# Altium schematic sheet OutputJack.SchDoc
size A4; CompanyName: Technische Hochschule Nürnberg Georg Simon Ohm; Address1: Fürther Straße 250; Address2: 90429 Nürnberg; Address3: GERMANY; SheetNumber: 11; SheetTotal: 21; CompanyName2: Institut ELSYS
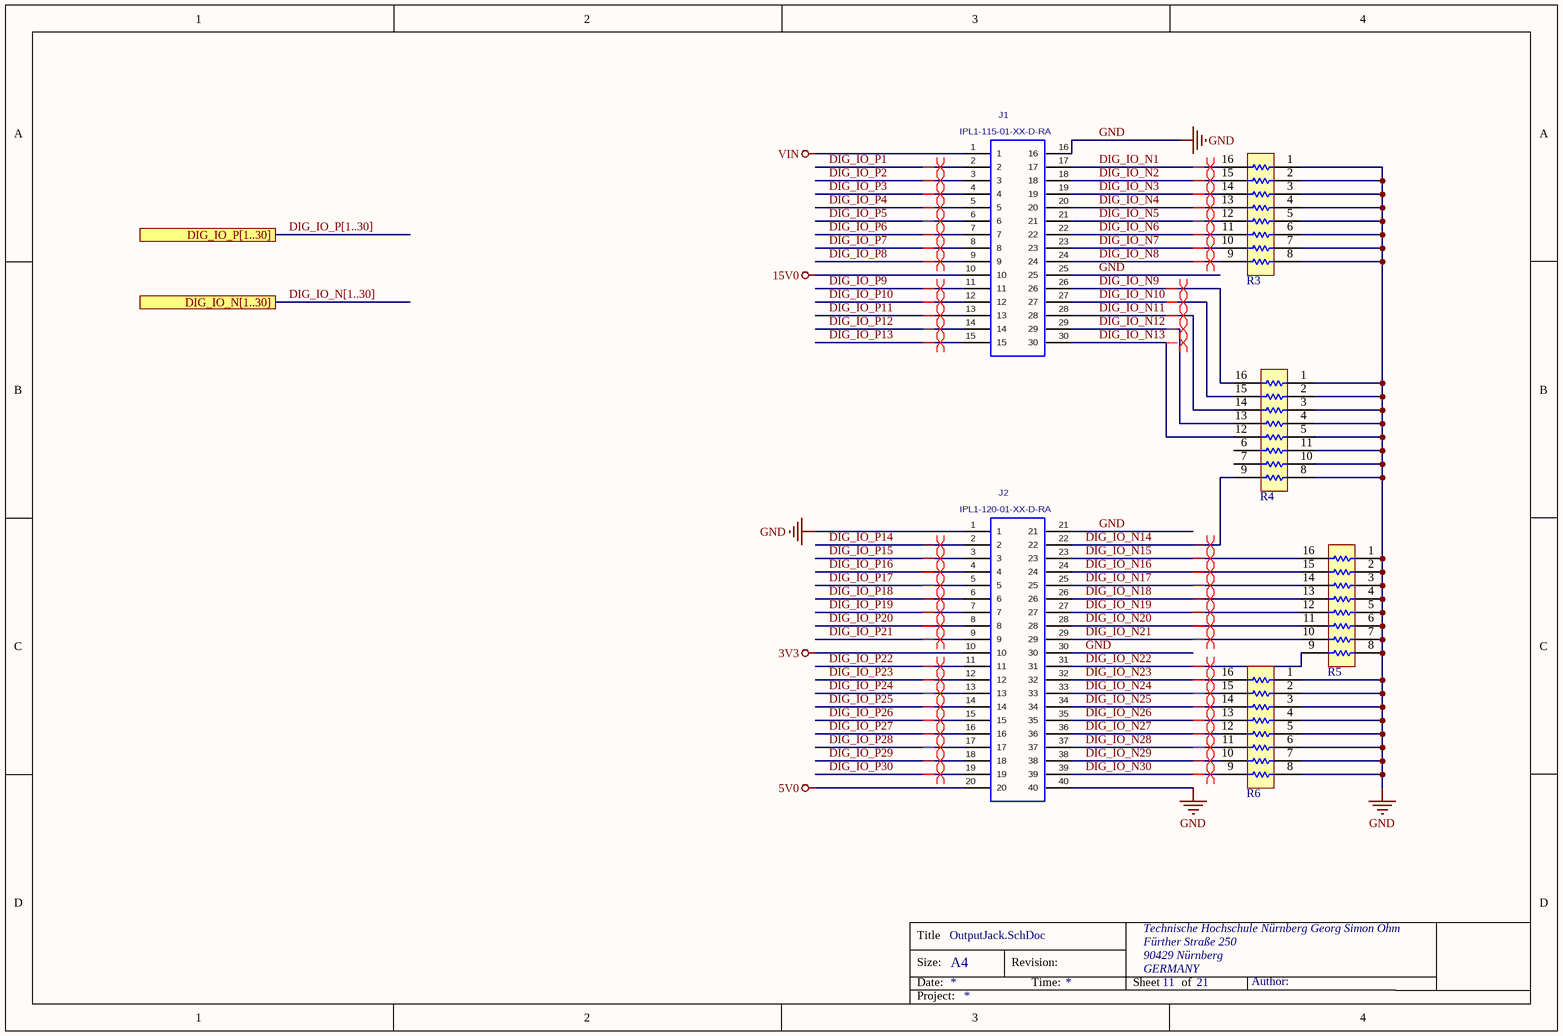
[diagram p0: OutputJack.SchDoc]

## Parts
J1  IPL1-115-01-XX-D-RA  [IPL1-115-01-XX-D-RA]
J2  IPL1-120-01-XX-D-RA  [IPL1-120-01-XX-D-RA]
R3  0.063W  [RESCAXE-50P380X160X45-16N]  (value not drawn)
R4  0.063W  [RESCAXE-50P380X160X45-16N]  (value not drawn)
R5  0.063W  [RESCAXE-50P380X160X45-16N]  (value not drawn)
R6  0.063W  [RESCAXE-50P380X160X45-16N]  (value not drawn)

## Ports
DIG_IO_N[1..30] (harness DIG_O_15V), DIG_IO_P[1..30] (harness DIG_O_15V)

## Nets
3V3: J2.10
5V0: J2.20
15V0: J1.10
GND: J1.16 J1.25 J2.1 J2.21 J2.30 J2.40 R3.1 R3.2 R3.3 R3.4 R3.5 R3.6 R3.7 R3.8 R4.1 R4.2 R4.3 R4.4 R4.5 R4.8 R4.10 R4.11 R5.1 R5.2 R5.3 R5.4 R5.5 R5.6 R5.7 R5.8 R6.1 R6.2 R6.3 R6.4 R6.5 R6.6 R6.7 R6.8
VIN: J1.1
DIG_IO_N1: J1.17 R3.16
DIG_IO_N2: J1.18 R3.15
DIG_IO_N3: J1.19 R3.14
DIG_IO_N4: J1.20 R3.13
DIG_IO_N5: J1.21 R3.12
DIG_IO_N6: J1.22 R3.11
DIG_IO_N7: J1.23 R3.10
DIG_IO_N8: J1.24 R3.9
DIG_IO_N9: J1.26 R4.16
DIG_IO_N10: J1.27 R4.15
DIG_IO_N11: J1.28 R4.14
DIG_IO_N12: J1.29 R4.13
DIG_IO_N13: J1.30 R4.12
DIG_IO_N14: J2.22 R4.9
DIG_IO_N15: J2.23 R5.16
DIG_IO_N16: J2.24 R5.15
DIG_IO_N17: J2.25 R5.14
DIG_IO_N18: J2.26 R5.13
DIG_IO_N19: J2.27 R5.12
DIG_IO_N20: J2.28 R5.11
DIG_IO_N21: J2.29 R5.10
DIG_IO_N22: J2.31 R5.9
DIG_IO_N23: J2.32 R6.16
DIG_IO_N24: J2.33 R6.15
DIG_IO_N25: J2.34 R6.14
DIG_IO_N26: J2.35 R6.13
DIG_IO_N27: J2.36 R6.12
DIG_IO_N28: J2.37 R6.11
DIG_IO_N29: J2.38 R6.10
DIG_IO_N30: J2.39 R6.9
DIG_IO_P1: J1.2
DIG_IO_P2: J1.3
DIG_IO_P3: J1.4
DIG_IO_P4: J1.5
DIG_IO_P5: J1.6
DIG_IO_P6: J1.7
DIG_IO_P7: J1.8
DIG_IO_P8: J1.9
DIG_IO_P9: J1.11
DIG_IO_P10: J1.12
DIG_IO_P11: J1.13
DIG_IO_P12: J1.14
DIG_IO_P13: J1.15
DIG_IO_P14: J2.2
DIG_IO_P15: J2.3
DIG_IO_P16: J2.4
DIG_IO_P17: J2.5
DIG_IO_P18: J2.6
DIG_IO_P19: J2.7
DIG_IO_P20: J2.8
DIG_IO_P21: J2.9
DIG_IO_P22: J2.11
DIG_IO_P23: J2.12
DIG_IO_P24: J2.13
DIG_IO_P25: J2.14
DIG_IO_P26: J2.15
DIG_IO_P27: J2.16
DIG_IO_P28: J2.17
DIG_IO_P29: J2.18
DIG_IO_P30: J2.19

Not connected (* = marked no-connect by the designer): R4 6 7

## Buses and harness runs
bus DIG_IO_N[1..30]
bus DIG_IO_P[1..30]

## Layout directives
differential pair: DIG_IO_N1, DIG_IO_N2, DIG_IO_N3, DIG_IO_N4, DIG_IO_N5, DIG_IO_N6, DIG_IO_N7, DIG_IO_N8, DIG_IO_N9, DIG_IO_N10, DIG_IO_N11, DIG_IO_N12, DIG_IO_N13, DIG_IO_N14, DIG_IO_N15, DIG_IO_N16, DIG_IO_N17, DIG_IO_N18, DIG_IO_N19, DIG_IO_N20, DIG_IO_N21, DIG_IO_N22, DIG_IO_N23, DIG_IO_N24, DIG_IO_N25, DIG_IO_N26, DIG_IO_N27, DIG_IO_N28, DIG_IO_N29, DIG_IO_N30, DIG_IO_P1, DIG_IO_P2, DIG_IO_P3, DIG_IO_P4, DIG_IO_P5, DIG_IO_P6, DIG_IO_P7, DIG_IO_P8, DIG_IO_P9, DIG_IO_P10, DIG_IO_P11, DIG_IO_P12, DIG_IO_P13, DIG_IO_P14, DIG_IO_P15, DIG_IO_P16, DIG_IO_P17, DIG_IO_P18, DIG_IO_P19, DIG_IO_P20, DIG_IO_P21, DIG_IO_P22, DIG_IO_P23, DIG_IO_P24, DIG_IO_P25, DIG_IO_P26, DIG_IO_P27, DIG_IO_P28, DIG_IO_P29, DIG_IO_P30

## Notes on the sheet
- Title
- Size:
- Date:
- A4
- Revision:
- Time:
- Sheet
- of
- Author:
- Project:

## Library data of the parts
J1 = IPL1-115-01-XX-D-RA: Terminal Assembly, Double Row, Right Angle, Thru-Hole, 0.100" x 0.100" Pitch, 30 Pins.; MPN1: IPL1-115-01-L-D-RA-K; MF1: SAMTEC; SPN1: 2018467; Created: 2019-12-17_Wendy_Xin; HelpURL: https://www.samtec.com/products/ipl1; ComponentLink1Description: Datasheet; ComponentLink1URL: http://suddendocs.samtec.com/catalog_english/ipl1.pdf; Supplier1: Farnell; Package: IPL1-115-01-XX-D-RA
J2 = IPL1-120-01-XX-D-RA: Terminal Assembly, Double Row, Right Angle, Thru-Hole, 0.100" x 0.100" Pitch, 40 Pins.; MPN1: IPL1-120-01-L-D-RA-K; MF1: SAMTEC; SPN1: 2018484; Created: 2019-07-18_Wendy Xin; Supplier1: Farnell; HelpURL: https://www.samtec.com/products/ipl1; Package: IPL1-120-01-XX-D-RA
R3-R6 = 8xR-Array_1_part: Standard thick film resistor array with 8 resistors; Manufacturer1: Panasonic; MPN1: EXB2HV<2dig_res+#zeros><tol/jumper>V; Parameter1: V; Parameter1Desc: Package Method; Parameter2: J; Parameter2Desc: Tolerance Symbol; MaxVoltage: 100; Created: 2020-01-03_Thilo_Wendt; Supplier1: https://de.farnell.com/w/search?range=inc-in-stock&st=exb2hv; Package: RESCAXE-50P380X160X45-16N; HelpURL: https://www.mouser.de/datasheet/2/315/AOC0000C14-1108062.pdf; Parameter3: *; Parameter3Desc: *; ComponentLink1Description: Datasheet; ComponentLink1URL: https://www.mouser.de/datasheet/2/315/AOC0000C14-1108062.pdf; ComponentLink2Description: Landpattern; ComponentLink2URL: https://industrial.panasonic.com/cdbs/www-data/pdf/AOC0000/AOC0000COL4.pdf